# Altium schematic sheet Logic.SchDoc: Title
size B; Organization: Midnight Sun Solar Rayce Car Team; Address1: University of Waterloo; Address2: 200 University Ave W; Address3: Waterloo, ON, Canada; Address4: N2L 3E9; Website: www.uwmidsun.com; ProjectName: ProjectName
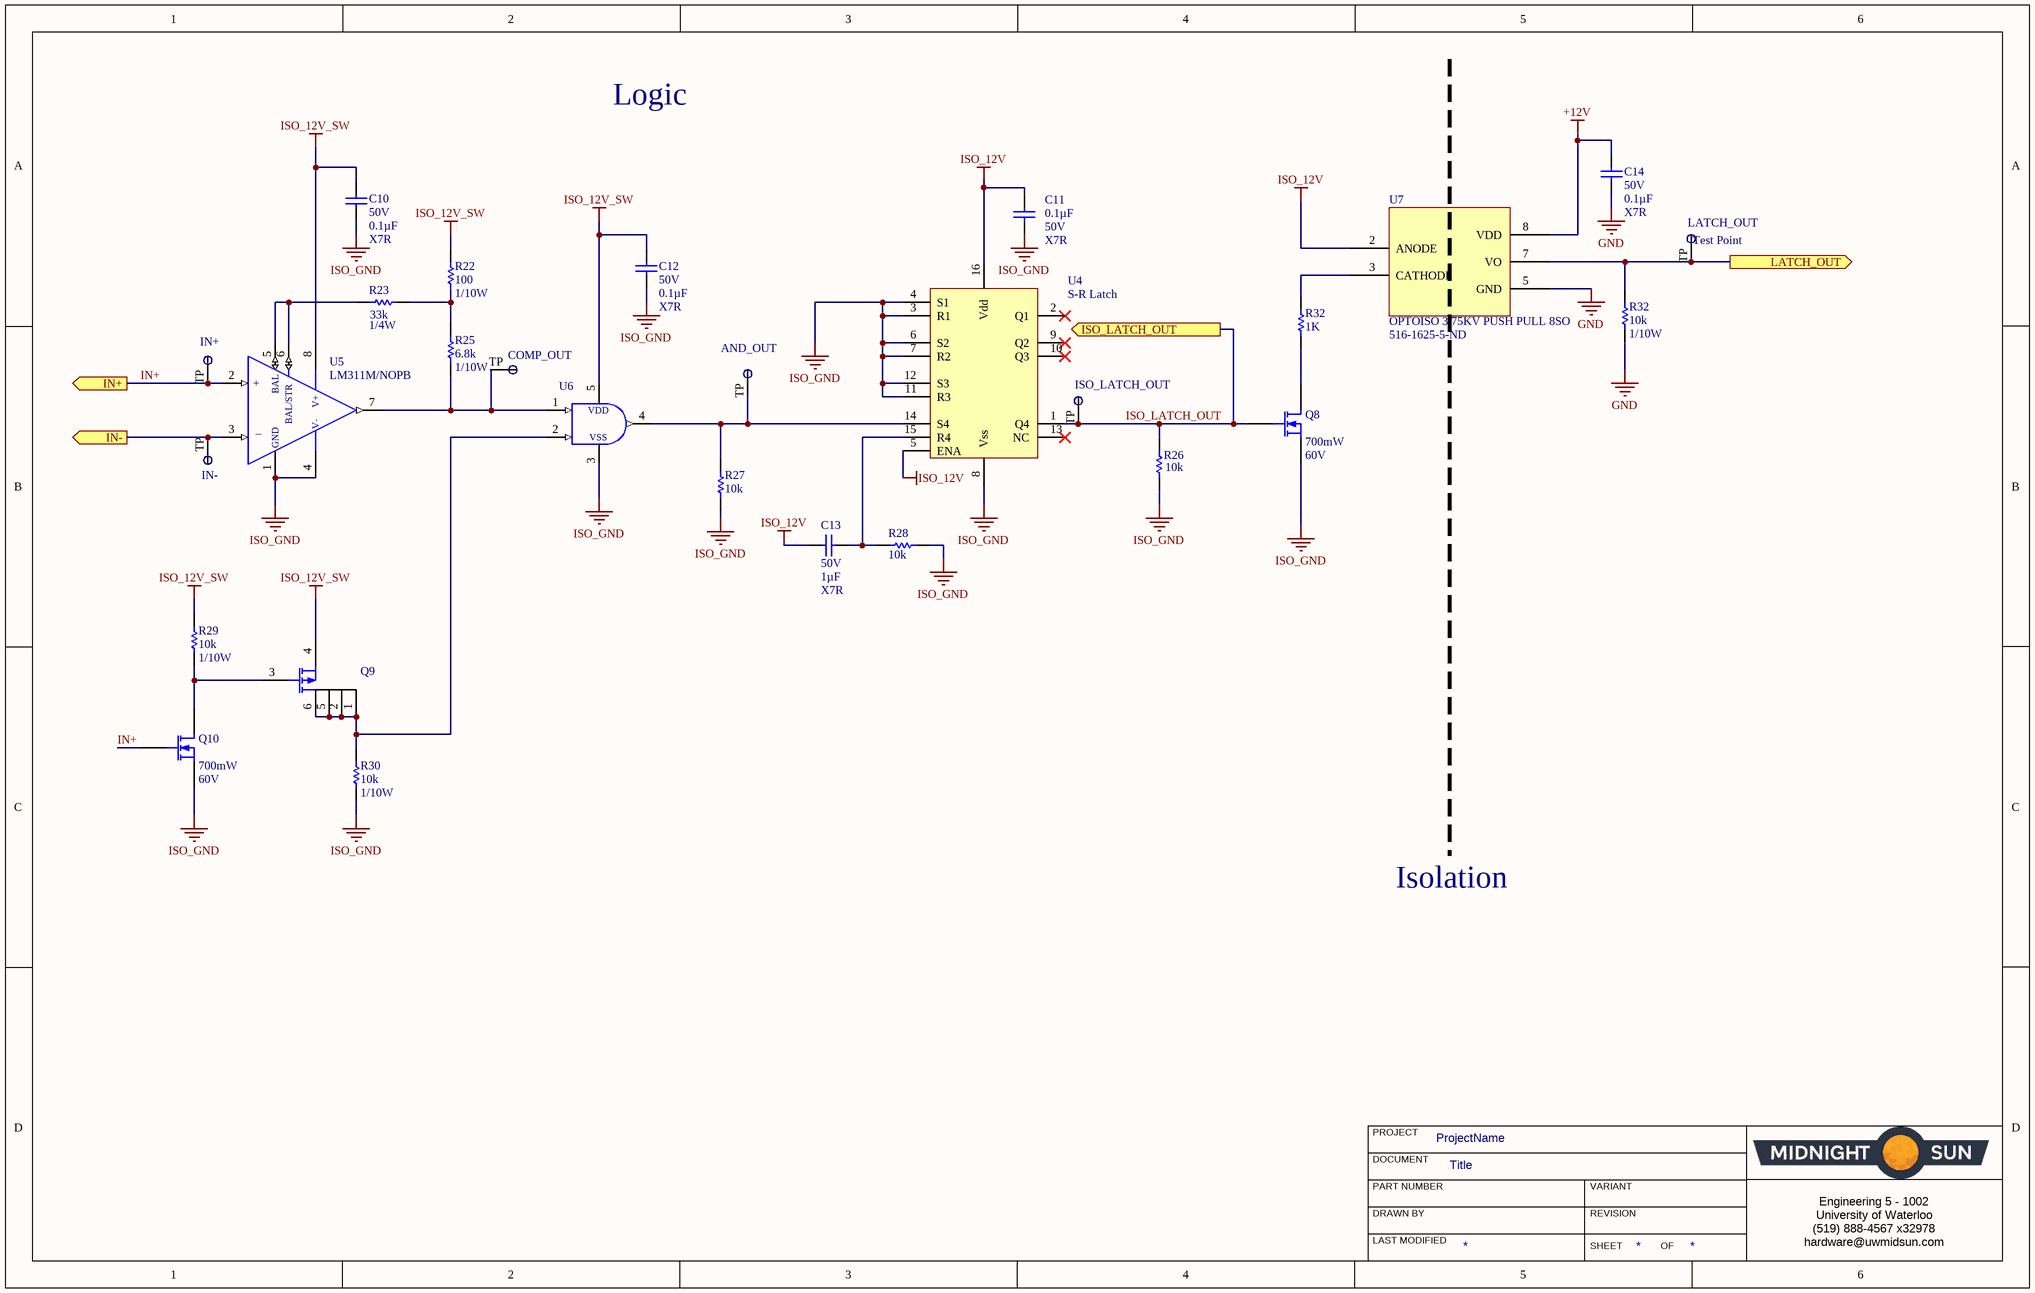
[diagram p0: Logic.SchDoc]

## Parts
(Parts that share a designator on the sheet are numbered #1, #2 ... from top to bottom, then left to right.)
AND_OUT  Test Point  [Test Point]  (value not drawn)  (no BOM)
C10  Voltage: 50V  Capacitance: 0.1µF  Temperature Coefficient: X7R  [CAP, 0603]  (hidden comment: CAP CER 0.1UF 50V 10% X7R 0603)
C11  Voltage: 50V  Capacitance: 0.1µF  Temperature Coefficient: X7R  [CAP, 0603]  (hidden comment: CAP CER 0.1UF 50V 10% X7R 0603)
C12  Voltage: 50V  Capacitance: 0.1µF  Temperature Coefficient: X7R  [CAP, 0603]  (hidden comment: CAP CER 0.1UF 50V 10% X7R 0603)
C13  Voltage: 50V  Capacitance: 1µF  Temperature Coefficient: X7R  [CAP, 0603]  (hidden comment: CAP CER 1UF 50V 10% X7R 0603)
C14  Voltage: 50V  Capacitance: 0.1µF  Temperature Coefficient: X7R  [CAP, 0603]  (hidden comment: CAP CER 0.1UF 50V 10% X7R 0603)
COMP_OUT  Test Point  [Test Point]  (value not drawn)  (no BOM)
IN+  Test Point  [Test Point]  (value not drawn)  (no BOM)
IN-  Test Point  [Test Point]  (value not drawn)  (no BOM)
ISO_LATCH_OUT  Test Point  [Test Point]  (value not drawn)  (no BOM)
LATCH_OUT  Test Point  [Test Point]  (no BOM)
Q8  Max Power Dissipation: 700mW  Drain to Source Voltage (Vdss): 60V  [SOT23]  (hidden comment: MOSFET N-CH 60V 310MA SOT23)
Q9  MOSFET P-CH 30V 4A 1.6W SOT-23-6  [P-MOSFET]  (value not drawn)
Q10  Max Power Dissipation: 700mW  Drain to Source Voltage (Vdss): 60V  [SOT23]  (hidden comment: MOSFET N-CH 60V 310MA SOT23)
R22  Resistance: 100  Power: 1/10W  [RES, 0603]  (hidden comment: RES 100 OHM 1% 1/10W 0603)
R23  Resistance: 33k  Power: 1/4W  [RES, 0603]  (hidden comment: RES 33K OHM 1% 1/4W 0603)
R25  Resistance: 6.8k  Power: 1/10W  [RES, 0603]  (hidden comment: RES 6.8k OHM 1% 1/10W 0603)
R26  Resistance: 10k  [RES, 0603]  (hidden comment: RES 10K OHM 1% 1/10W 0603)
R27  Resistance: 10k  [RES, 0603]  (hidden comment: RES 10K OHM 1% 1/10W 0603)
R28  Resistance: 10k  [RES, 0603]  (hidden comment: RES 10K OHM 1% 1/10W 0603)
R29  Resistance: 10k  Power: 1/10W  [RES, 0603]  (hidden comment: RES 10K OHM 1% 1/10W 0603)
R30  Resistance: 10k  Power: 1/10W  [RES, 0603]  (hidden comment: RES 10K OHM 1% 1/10W 0603)
R32#1  Resistance: 10k  Power: 1/10W  [RES, 0603]  (hidden comment: RES 10K OHM 1% 1/10W 0603)
R32#2  1K  [RES, 0603]
U4  Logic Type: S-R Latch  [IC, SR Latch, CD4043BDR]  (hidden comment: IC SR LATCH 4CH 16SOIC)
U5  Manufacturer Part Number 1: LM311M/NOPB  [SOIC8]  (hidden comment: IC COMPARATOR 8-SOIC)
U6  IC AND GATE 1CH 5-SSOP  [IC, 2-Input AND Gate]  (value not drawn)
U7  OPTOISO 3.75KV PUSH PULL 8SO  Supplier Part Number 1: 516-1625-5-ND  [SOIC8]

## Ports
IN+ (out), IN- (out), ISO_LATCH_OUT (out), LATCH_OUT (out)

## Nets
+12V: C14.1 U7.8(VDD)
GND: C14.2 R32#1.2 U7.5(GND)
ISO_12V: C11.2 C13.2 U4.5(ENA) U4.16(Vdd) U7.2(ANODE)
ISO_12V_SW: C10.2 C12.2 Q9.4(S) R22.1 R29.1 U5.8(V+) U6.5(VCC)
ISO_GND: C10.1 C11.1 C12.1 Q8.2(S) Q10.2(S) R26.1 R27.1 R28.1 R30.2 U4.3(R1) U4.4(S1) U4.6(S2) U4.7(R2) U4.8(Vss) U4.11(R3) U4.12(S3) U5.1(GND) U5.4(V-) U6.3(GND)
IN+: IN+.TP Q10.3(G) U5.2(+IN) ; port IN+
IN-: IN-.TP U5.3(-IN) ; port IN-
ISO_LATCH_OUT: ISO_LATCH_OUT.TP Q8.3(G) R26.2 U4.1(Q4) ; port ISO_LATCH_OUT
LATCH_OUT: LATCH_OUT.TP R32#1.1 U7.7(VO) ; port LATCH_OUT
NetAND_OUT_TP: AND_OUT.TP R27.2 U4.14(S4) U6.4(Y)
NetC13_1: C13.1 R28.2 U4.15(R4)
NetCOMP_OUT_TP: COMP_OUT.TP R25.2 U5.7(OUTPUT) U6.1(A)
NetQ8_1: Q8.1(D) R32#2.1
NetQ9_1: Q9.1(D) Q9.2(D) Q9.5(D) Q9.6(D) R30.1 U6.2(B)
NetQ9_3: Q9.3(G) Q10.1(D) R29.2
NetR22_2: R22.2 R23.2 R25.1
NetR23_1: R23.1 U5.5(BAL) U5.6(BAL/STR)
NetR32#2_2: R32#2.2 U7.3(CATHODE)

Not connected (* = marked no-connect by the designer): U4 2(Q1)* 9(Q2)* 10(Q3)* 13(NC)*

## Notes on the sheet
- Logic
- Isolation
- PROJECT
- DOCUMENT
- DRAWN BY
- LAST MODIFIED
- PART NUMBER
- REVISION
- SHEET
- VARIANT
- OF
- Engineering 5 - 1002
  University of Waterloo
  (519) 888-4567 x32978
  hardware@uwmidsun.com
- (in symbol IC AND GATE 1CH 5-SSOP) VDD; VSS
- (in symbol IC COMPARATOR 8-SOIC) +; _

## Library data of the parts
C10-C12 C14 = CAP CER 0.1UF 50V 10% X7R 0603: 0.10µF ±10% 50V Ceramic Capacitor X7R 0603 (1608 Metric); Manufacturer 1: AVX Corporation; Manufacturer Part Number 1: 06035C104KAT2A; Supplier 1: Digi-Key; Supplier Part Number 1: 478-5052-1-ND; Packaging: Cut Tape (CT); Part Status: Active; Operating Temperature: -55°C ~ 125°C; Ratings: -; Mounting Type: Surface Mount, MLCC; Package / Case: 0603 (1608 Metric); Size / Dimension: 0.063" L x 0.032" W (1.60mm x 0.81mm); Height - Seated (Max): -; Thickness (Max): 0.035" (0.90mm); Lead Spacing: -; Lead Style: -; ComponentLink1URL: http://datasheets.avx.com/X7RDielectric.pdf; ComponentLink1Description: http://datasheets.avx.com/X7RDielectric.pdf; Tolerance: ±10%
C13 = CAP CER 1UF 50V 10% X7R 0603: 1µF ±10% 50V Ceramic Capacitor X7R 0603 (1608 Metric); Manufacturer 1: Taiyo Yuden; Manufacturer Part Number 1: UMK107AB7105KA-T; Supplier 1: Digi-Key; Supplier Part Number 1: 587-3247-1-ND; Packaging: Cut Tape (CT); Part Status: Active; Operating Temperature: -55°C ~ 125°C; Ratings: -; Mounting Type: Surface Mount, MLCC; Package / Case: 0603 (1608 Metric); Size / Dimension: 0.063" L x 0.031" W (1.60mm x 0.80mm); Height - Seated (Max): -; Thickness (Max): 0.037" (0.95mm); Lead Spacing: -; Lead Style: -; ComponentLink1URL: http://www.yuden.co.jp/productdata/catalog/en/mlcc_all_e.pdf; ComponentLink1Description: http://www.yuden.co.jp/productdata/catalog/en/mlcc_all_e.pdf; Tolerance: ±10%
Q8 Q10 = MOSFET N-CH 60V 310MA SOT23: N-Channel 60V 310mA (Ta) 370mW (Ta) Surface Mount SOT-23; Manufacturer: Diodes; Manufacturer Part Number: DMN6140L-7; Rds On Max: 140mR; Input Capacitance: 315pF; Continuous Drain Current (ID): 1.6A; Threshold Voltage: 3V; Element Configuration: Single; Number of Channels: 1; Gate to Source Voltage (Vgs): 20V; Fall Time: 2.7ns; Rise Time: 3.6ns; Turn-Off Delay Time: 16.3ns; Turn-On Delay Time: 2.6ns; Power Dissipation: 540mW; FET Type: 1 N-Channel; Supplier 1: Digi-Key; Stock 1: 0; Mount: Surface Mount; Case/Package: TO-236-3; Number of Pins: 3; Weight: 0.000282oz; Min Operating Temperature: -55°C; Max Operating Temperature: 150°C; Package Quantity: 3000; Packaging: Tape and Reel; Drain to Source Resistance: 140mR; REACH SVHC: No SVHC; Lead Free: Lead Free; ComponentLink1URL: https://datasheet.ciiva.com/29747/dmn6140l-29747654.pdf; ComponentLink1Description: https://datasheet.ciiva.com/29747/dmn6140l-29747654.pdf; ComponentLink2URL: https://datasheet.ciiva.com/29747/dmn6140l-29747660.pdf; ComponentLink2Description: https://datasheet.ciiva.com/29747/dmn6140l-29747660.pdf; Supplier Part Number 1: DMN65D8L-7DICT-ND; Drain to Source Breakdown Voltage: 60V; Number of Elements: 1; Length: 3mm; Height: 1.1mm; Width: 1.4mm; ComponentLink3URL: https://datasheet.ciiva.com/6371/dmn65d8l-6371124.pdf; ComponentLink3Description: https://datasheet.ciiva.com/6371/dmn65d8l-6371124.pdf; ComponentLink4URL: https://datasheet.ciiva.com/6371/dmn65d8l-6371126.pdf; ComponentLink4Description: https://datasheet.ciiva.com/6371/dmn65d8l-6371126.pdf; ComponentLink5URL: https://datasheet.ciiva.com/13058/dmn65d8l-219098-13058455.pdf; ComponentLink5Description: https://datasheet.ciiva.com/13058/dmn65d8l-219098-13058455.pdf; ComponentLink6URL: https://datasheet.ciiva.com/6371/dmn65d8l-6371128.pdf; ComponentLink6Description: https://datasheet.ciiva.com/6371/dmn65d8l-6371128.pdf
Q9 = MOSFET P-CH 30V 4A 1.6W SOT-23-6: P-Channel 30V 4A (Ta) 1.6W (Ta) Surface Mount SOT-23-6; Manufacturer 1: STMicroelectronics; Manufacturer Part Number 1: STT4P3LLH6; Current - Continuous Drain (Id) @ 25°C: 4A (Ta); Drive Voltage (Max Rds On,  Min Rds On): 4.5V, 10V; Vgs(th) (Max) @ Id: 2.5V @ 250µA; Gate Charge (Qg) (Max) @ Vgs: 6nC @ 4.5V; Input Capacitance (Ciss) (Max) @ Vds: 639pF @ 25V; Vgs (Max): ±20V; Rds On (Max) @ Id, Vgs: 56 mOhm @ 2A, 10V; Supplier 1: Digi-Key; Supplier Part Number 1: 497-15521-1-ND; Packaging: Cut Tape (CT); Part Status: Active; FET Type: P-Channel; Technology: MOSFET (Metal Oxide); Drain to Source Voltage (Vdss): 30V; FET Feature: -; Power Dissipation (Max): 1.6W (Ta); Operating Temperature: 150°C (TJ); Mounting Type: Surface Mount; Supplier Device Package: SOT-23-6; Package / Case: SOT-23-6; ComponentLink1URL: http://www.st.com/content/ccc/resource/technical/document/datasheet/13/e4/a1/65/8b/79/44/73/DM00084060.pdf/files/DM00084060.pdf/jcr:content/translations/en.DM00084060.pdf; ComponentLink1Description: http://www.st.com/content/ccc/resource/technical/document/datasheet/13/e4/a1/65/8b/79/44/73/DM00084060.pdf/files/DM00084060.pdf/jcr:content/translations/en.DM00084060.pdf
R22 = RES 100 OHM 1% 1/10W 0603: 100 Ohm ±1% 0.1W, 1/10W Chip Resistor 0603 (1608 Metric) Moisture Resistant Thick Film; Manufacturer 1: Yageo; Manufacturer Part Number 1: RC0603FR-07100RL; Temperature Coefficient: ±100ppm/°C; Supplier 1: Digi-Key; Supplier Part Number 1: 311-100HRCT-ND; Packaging: Cut Tape (CT); Part Status: Active; Composition: Thick Film; Operating Temperature: -55°C ~ 155°C; Package / Case: 0603 (1608 Metric); Supplier Device Package: 0603; Size / Dimension: 0.063" L x 0.031" W (1.60mm x 0.80mm); Height - Seated (Max): 0.022" (0.55mm); Failure Rate: -; ComponentLink1URL: http://www.yageo.com/documents/recent/PYu-RC_Group_51_RoHS_L_7.pdf; ComponentLink1Description: http://www.yageo.com/documents/recent/PYu-RC_Group_51_RoHS_L_7.pdf; Tolerance: ±1%
R23 = RES 33K OHM 1% 1/4W 0603: RES SMD 33K OHM 1% 1/4W 0603; Manufacturer 1: Panasonic Electronic Components; Manufacturer Part Number 1: ERJ-PA3F3302V; Temperature Coefficient: ±100ppm/°C; Supplier 1: Digi-Key; Supplier Part Number 1: P33KBYCT-ND; Packaging: Cut Tape (CT); Part Status: Active; Composition: Thick Film; Operating Temperature: -55°C ~ 155°C; Package / Case: 0603 (1608 Metric); Supplier Device Package: 0603; Size / Dimension: 0.063" L x 0.031" W (1.60mm x 0.80mm); Height - Seated (Max): 0.022" (0.55mm); Failure Rate: -; ComponentLink1URL: https://industrial.panasonic.com/cdbs/www-data/pdf/RDO0000/AOA0000C291.pdf; ComponentLink1Description: https://industrial.panasonic.com/cdbs/www-data/pdf/RDO0000/AOA0000C291.pdf; Tolerance: ±1%
R25 = RES 6.8k OHM 1% 1/10W 0603: RES SMD 6.8K OHM 1% 1/10W 0603; Manufacturer 1: Stackpole Electronics Inc.; Manufacturer Part Number 1: RMCF0603FT6K80; Temperature Coefficient: ±100ppm/°C; Supplier 1: Digi-Key; Supplier Part Number 1: RMCF0603FT6K80CT-ND; Packaging: Cut Tape (CT); Part Status: Active; Composition: Thick Film; Operating Temperature: -55°C ~ 155°C; Package / Case: 0603 (1608 Metric); Supplier Device Package: 0603; Size / Dimension: 0.061" L x 0.031" W (1.55mm x 0.80mm); Height - Seated (Max): 0.022" (0.55mm); Failure Rate: -; ComponentLink1URL: https://www.seielect.com/Catalog/SEI-RMCF_RMCP.pdf; ComponentLink1Description: https://www.seielect.com/Catalog/SEI-RMCF_RMCP.pdf; Tolerance: ±1%
R26-R30 R32#1 = RES 10K OHM 1% 1/10W 0603: RES SMD 10K OHM 1% 1/10W 0603; Manufacturer 1: Yageo; Manufacturer Part Number 1: RC0603FR-0710KL; Temperature Coefficient: ±100ppm/°C; Supplier 1: Digi-Key; Supplier Part Number 1: 311-10.0KHRCT-ND; Packaging: Cut Tape (CT); Part Status: Active; Composition: Thick Film; Operating Temperature: -55°C ~ 155°C; Package / Case: 0603 (1608 Metric); Supplier Device Package: 0603; Size / Dimension: 0.063" L x 0.031" W (1.60mm x 0.80mm); Height - Seated (Max): 0.022" (0.55mm); Failure Rate: -; ComponentLink1URL: http://www.yageo.com/documents/recent/PYu-RC_Group_51_RoHS_L_7.pdf; ComponentLink1Description: http://www.yageo.com/documents/recent/PYu-RC_Group_51_RoHS_L_7.pdf; Tolerance: ±1%
  R26-R28: Power: 1/10W
R32#2 = RES 1K OHM 5% 1/10W 0603: 1k Ohm ±5% 0.1W, 1/10W Chip Resistor 0603 (1608 Metric); Manufacturer: Yageo; Manufacturer Part Number: RC0603JR-071KL; Temperature Coefficient: ±100ppm/°C; Supplier 1: Digi-Key; Supplier Part Number 1: 311-1.0KGRCT-ND; RoHS: RoHS Compliant; Category: Resistors; Stock 1: 4415240; Pricing 1: 1=0.15, 10=0.017, 100=0.0071, 1000=0.0032, 2500=0.00278 (CAD); Packaging: Cut Tape (CT); Part Status: Active; Resistance (Ohms): 1k; Tolerance: ±5%; Power (Watts): 0.1W, 1/10W; Composition: Thick Film; Features: Moisture Resistant; Operating Temperature: -55°C ~ 155°C; Package / Case: 0603 (1608 Metric); Supplier Device Package: 0603; Size / Dimension: 0.063" L x 0.031" W (1.60mm x 0.80mm); Height - Seated (Max): 0.022" (0.55mm); Failure Rate: -; ComponentLink1URL: http://www.yageo.com/documents/recent/PYu-RC_Group_51_RoHS_L_7.pdf; ComponentLink1Description: http://www.yageo.com/documents/recent/PYu-RC_Group_51_RoHS_L_7.pdf
U4 = IC SR LATCH 4CH 16SOIC: S-R Latch 4 Channel 1:1 IC Tri-State 16-TSSOP; Manufacturer 1: Texas Instruments; Manufacturer Part Number 1: CD4043BDR; Voltage - Supply: 3 V ~ 18 V; Delay Time - Propagation: 50ns; Current - Output High, Low: 6.8mA, 6.8mA; Supplier 1: Digi-Key; Supplier Part Number 1: 296-31496-1-ND; Packaging: Cut Tape (CT); Part Status: Active; Circuit: 1:1; Output Type: Tri-State; Operating Temperature: -55°C ~ 125°C; Mounting Type: Surface Mount; Package / Case: 16-SOIC (0.154", 3.90mm Width); Supplier Device Package: 16-SOIC; ComponentLink1URL: http://www.ti.com/lit/ds/symlink/cd4043b.pdf; ComponentLink1Description: http://www.ti.com/lit/ds/symlink/cd4043b.pdf
U5 = IC COMPARATOR 8-SOIC: Comparator General Purpose DTL, MOS, Open-Collector, Open-Emitter, RTL, TTL 8-SOIC; Manufacturer 1: Texas Instruments; Voltage - Supply, Single/Dual (±): 5 V ~ 36 V, ±2.5 V ~ 18 V; Voltage - Input Offset (Max): 7.5mV @ ±15V; Current - Input Bias (Max): 0.25µA @ ±15V; Current - Quiescent (Max): 7.5mA; Supplier 1: Digi-Key; Supplier Part Number 1: LM311MNS/NOPB-ND; Packaging: Tube; Part Status: Active; Type: General Purpose; Output Type: DTL, MOS, Open-Collector, Open-Emitter, RTL, TTL; Current - Output (Typ): -; CMRR, PSRR (Typ): -; Propagation Delay (Max): -; Hysteresis: -; Operating Temperature: 0°C ~ 70°C; Package / Case: 8-SOIC (0.154", 3.90mm Width); Mounting Type: Surface Mount; Supplier Device Package: 8-SOIC; ComponentLink1URL: http://www.ti.com/lit/ds/symlink/lm311-n.pdf; ComponentLink1Description: http://www.ti.com/lit/ds/symlink/lm311-n.pdf
U6 = IC AND GATE 1CH 5-SSOP: AND Gate IC 1 Channel 5-SSOP; Manufacturer 1: Rohm Semiconductor; Manufacturer Part Number 1: BU4S81G2-TR; Logic Level - Low: 1.5 V ~ 4 V; Logic Level - High: 3.5 V ~ 11 V; Number of Circuits: 1; Number of Inputs: 2; Voltage - Supply: 3 V ~ 16 V; Current - Quiescent (Max): 1µA; Current - Output High, Low: 3.4mA, 3.4mA; Max Propagation Delay @ V, Max CL: 30ns @ 15V, 50pF; Supplier 1: Digi-Key; Supplier Part Number 1: BU4S81G2CT-ND; Packaging: Cut Tape (CT); Part Status: Active; Operating Temperature: -40°C ~ 85°C; Mounting Type: Surface Mount; Supplier Device Package: 5-SSOP; Package / Case: SC-74A, SOT-753; ComponentLink1URL: http://rohmfs.rohm.com/en/products/databook/datasheet/ic/logic_switch/standard_logic/bu4s81g2-e.pdf; ComponentLink1Description: http://rohmfs.rohm.com/en/products/databook/datasheet/ic/logic_switch/standard_logic/bu4s81g2-e.pdf; Logic Type: AND Gate
U7 = OPTOISO 3.75KV PUSH PULL 8SO: Logic Output Optoisolator 5MBd Push-Pull, Totem Pole 3750Vrms 1 Channel 5kV/µs, 10kV/µs CMTI 8-SO Tall; ComponentLink1Description: https://www.digikey.ca/products/en?keywords=HCPL-0211-000E; ComponentLink1URL: https://www.digikey.ca/products/en?keywords=HCPL-0211-000E; Supplier 1: Digi-Key